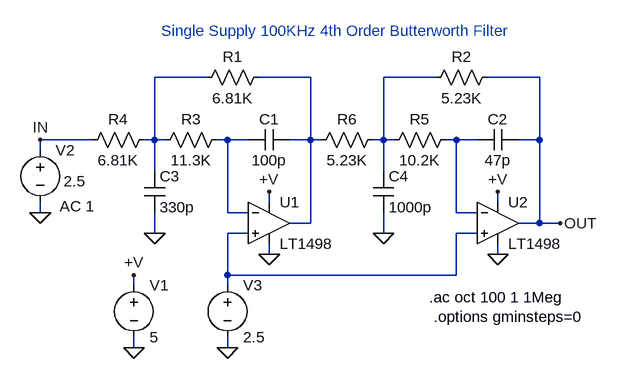
[diagram p0: schematic 1498.asc]
1498.asc, the LTspice schematic file:
Version 4
SHEET 1 896 680
WIRE 96 16 16 16
WIRE 256 16 176 16
WIRE 448 16 368 16
WIRE 608 16 528 16
WIRE -80 112 -160 112
WIRE 16 112 16 16
WIRE 16 112 0 112
WIRE 32 112 16 112
WIRE 128 112 112 112
WIRE 160 112 128 112
WIRE 256 112 256 16
WIRE 256 112 224 112
WIRE 272 112 256 112
WIRE 368 112 368 16
WIRE 368 112 352 112
WIRE 384 112 368 112
WIRE 480 112 464 112
WIRE 512 112 480 112
WIRE 608 112 608 16
WIRE 608 112 576 112
WIRE -160 128 -160 112
WIRE 16 160 16 112
WIRE 368 160 368 112
WIRE 192 208 192 192
WIRE 544 208 544 192
WIRE -160 224 -160 208
WIRE 128 224 128 112
WIRE 160 224 128 224
WIRE 480 224 480 112
WIRE 512 224 480 224
WIRE 256 240 256 112
WIRE 256 240 224 240
WIRE 608 240 608 112
WIRE 608 240 576 240
WIRE 640 240 608 240
WIRE 16 256 16 224
WIRE 160 256 128 256
WIRE 368 256 368 224
WIRE 512 256 480 256
WIRE 192 288 192 272
WIRE 544 288 544 272
WIRE 128 320 128 256
WIRE 480 320 480 256
WIRE 480 320 128 320
WIRE -16 336 -16 320
WIRE 128 336 128 320
WIRE -16 432 -16 416
WIRE 128 432 128 416
FLAG -16 432 0
FLAG 192 192 +V
FLAG -16 320 +V
FLAG 128 432 0
FLAG 192 288 0
FLAG -160 224 0
FLAG 544 192 +V
FLAG 544 288 0
FLAG 16 256 0
FLAG 368 256 0
FLAG 640 240 OUT
FLAG -160 112 IN
SYMBOL voltage -16 320 R0
SYMATTR InstName V1
SYMATTR Value 5
SYMBOL res 192 0 R90
WINDOW 0 0 56 VBottom 0
WINDOW 3 32 56 VTop 0
SYMATTR InstName R1
SYMATTR Value 6.81K
SYMBOL voltage 128 320 R0
SYMATTR InstName V3
SYMATTR Value 2.5
SYMBOL opamps\\LT1498 192 176 R0
SYMATTR InstName U1
SYMBOL cap 224 96 R90
WINDOW 0 0 32 VBottom 0
WINDOW 3 32 32 VTop 0
SYMATTR InstName C1
SYMATTR Value 100p
SYMBOL res 128 96 R90
WINDOW 0 0 56 VBottom 0
WINDOW 3 32 56 VTop 0
SYMATTR InstName R3
SYMATTR Value 11.3K
SYMBOL res 16 96 R90
WINDOW 0 0 56 VBottom 0
WINDOW 3 32 56 VTop 0
SYMATTR InstName R4
SYMATTR Value 6.81K
SYMBOL voltage -160 112 R0
WINDOW 3 36 64 Left 0
WINDOW 123 30 102 Left 0
WINDOW 39 0 0 Left 0
SYMATTR InstName V2
SYMATTR Value 2.5
SYMATTR Value2 AC 1
SYMBOL res 544 0 R90
WINDOW 0 0 56 VBottom 0
WINDOW 3 32 56 VTop 0
SYMATTR InstName R2
SYMATTR Value 5.23K
SYMBOL opamps\\LT1498 544 176 R0
SYMATTR InstName U2
SYMBOL cap 576 96 R90
WINDOW 0 0 32 VBottom 0
WINDOW 3 32 32 VTop 0
SYMATTR InstName C2
SYMATTR Value 47p
SYMBOL res 480 96 R90
WINDOW 0 0 56 VBottom 0
WINDOW 3 32 56 VTop 0
SYMATTR InstName R5
SYMATTR Value 10.2K
SYMBOL res 368 96 R90
WINDOW 0 0 56 VBottom 0
WINDOW 3 32 56 VTop 0
SYMATTR InstName R6
SYMATTR Value 5.23K
SYMBOL cap 0 160 R0
SYMATTR InstName C3
SYMATTR Value 330p
SYMBOL cap 352 160 R0
SYMATTR InstName C4
SYMATTR Value 1000p
TEXT 438 354 Left 0 !.ac oct 100 1 1Meg
TEXT 560 400 Bottom 0 !.options gminsteps=0
TEXT 296 -40 Bottom 0 ;Single Supply 100KHz 4th Order Butterworth Filter

The netlist it stands for:
* 1498.asc
V1 +V 0 5
R1 N002 N001 6.81K
V3 N006 0 2.5
XU1 N006 N004 +V 0 N002 LT1498  ; pins In+ In- V+ V- OUT
C1 N002 N004 100p
R3 N004 N001 11.3K
R4 N001 IN 6.81K
V2 IN 0 2.5 AC 1
R2 OUT N003 5.23K
XU2 N006 N005 +V 0 OUT LT1498  ; pins In+ In- V+ V- OUT
C2 OUT N005 47p
R5 N005 N003 10.2K
R6 N003 N002 5.23K
C3 N001 0 330p
C4 N003 0 1000p
.ac oct 100 1 1Meg
.options gminsteps=0
* Single Supply 100KHz 4th Order Butterworth Filter
.lib LTC.lib
.backanno
.end